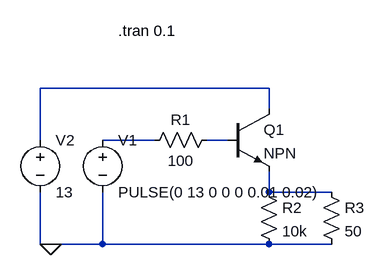
[diagram p0: schematic EmitterFollower.asc]
EmitterFollower.asc, the LTspice schematic file:
Version 4
SHEET 1 880 680
WIRE 560 192 208 192
WIRE 560 224 560 192
WIRE 208 272 208 192
WIRE 384 272 304 272
WIRE 496 272 464 272
WIRE 560 352 560 320
WIRE 656 352 560 352
WIRE 208 432 208 352
WIRE 224 432 208 432
WIRE 304 432 304 352
WIRE 304 432 224 432
WIRE 560 432 304 432
WIRE 656 432 560 432
FLAG 224 432 0
SYMBOL voltage 304 256 R0
SYMATTR InstName V1
SYMATTR Value PULSE(0 13 0 0 0 0.01 0.02)
SYMBOL npn 496 224 R0
SYMATTR InstName Q1
SYMBOL res 480 256 R90
WINDOW 0 0 56 VBottom 2
WINDOW 3 32 56 VTop 2
SYMATTR InstName R1
SYMATTR Value 100
SYMBOL res 544 336 R0
SYMATTR InstName R2
SYMATTR Value 10k
SYMBOL voltage 208 256 R0
SYMATTR InstName V2
SYMATTR Value 13
SYMBOL res 640 336 R0
SYMATTR InstName R3
SYMATTR Value 50
TEXT 328 104 Left 2 !.tran 0.1

The netlist it stands for:
* EmitterFollower.asc
V1 N002 0 PULSE(0 13 0 0 0 0.01 0.02)
Q1 N001 N003 N004 0 NPN
R1 N003 N002 100
R2 N004 0 10k
V2 N001 0 13
R3 N004 0 50
.model NPN NPN
.model PNP PNP
.lib standard.bjt
.tran 0.1
.backanno
.end